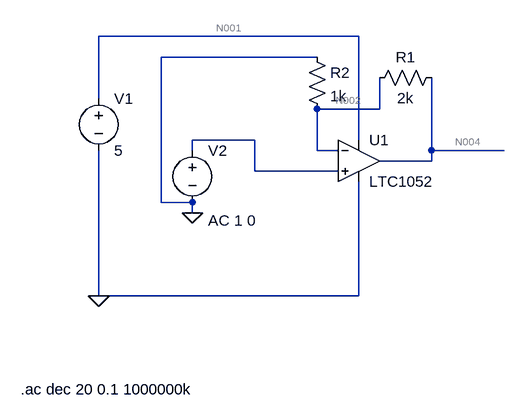
[diagram p0: schematic Non-invertAmp.asc]
Non-invertAmp.asc, the LTspice schematic file:
Version 4
SHEET 1 880 680
WIRE 224 -112 -176 -112
WIRE 160 -80 -80 -80
WIRE -176 -16 -176 -112
WIRE 256 0 256 -48
WIRE 256 0 160 0
WIRE 64 48 -32 48
WIRE 224 48 224 -112
WIRE -32 64 -32 48
WIRE 160 64 160 0
WIRE 192 64 160 64
WIRE 336 64 336 -48
WIRE 448 64 336 64
WIRE 336 80 336 64
WIRE 336 80 256 80
WIRE 64 96 64 48
WIRE 192 96 64 96
WIRE -80 144 -80 -80
WIRE -32 144 -80 144
WIRE -32 160 -32 144
WIRE -176 288 -176 64
WIRE 224 288 224 112
WIRE 224 288 -176 288
FLAG -32 160 0
FLAG -176 288 0
SYMBOL voltage -176 -32 R0
WINDOW 123 0 0 Left 2
WINDOW 39 0 0 Left 2
SYMATTR InstName V1
SYMATTR Value 5
SYMBOL voltage -32 48 R0
WINDOW 123 24 124 Left 2
WINDOW 39 0 0 Left 2
SYMATTR Value2 AC 1 0
SYMATTR InstName V2
SYMATTR Value ""
SYMBOL res 144 -96 R0
SYMATTR InstName R2
SYMATTR Value 1k
SYMBOL res 352 -64 R90
WINDOW 0 0 56 VBottom 2
WINDOW 3 32 56 VTop 2
SYMATTR InstName R1
SYMATTR Value 2k
SYMBOL Opamps\\LTC1052 224 16 R0
SYMATTR InstName U1
TEXT -296 432 Left 2 !.ac dec 20 0.1 1000000k

The netlist it stands for:
* Non-invertAmp.asc
V1 N001 0 5
V2 N003 0 AC 1 0
R2 0 N002 1k
R1 N004 N002 2k
XU1 N003 N002 N001 0 N004 LTC1052  ; pins In+ In- V+ V- OUT
.ac dec 20 0.1 1000000k
.backanno
.end

* Results of the author's LTspice run, read from the files saved beside the schematic
* Operating Point, zero values left out:
*   V(n001) = 5 V
*   V(n002) = 21.41 mV
*   V(n004) = 64.23 mV
*   I(R1) = 21.41 µA
*   I(R2) = -21.41 µA
*   I(V1) = -1.384 mA
*   Ix(u1:3) = 1.384 mA
*   Ix(u1:4) = -1.363 mA
*   Ix(u1:5) = -21.41 µA
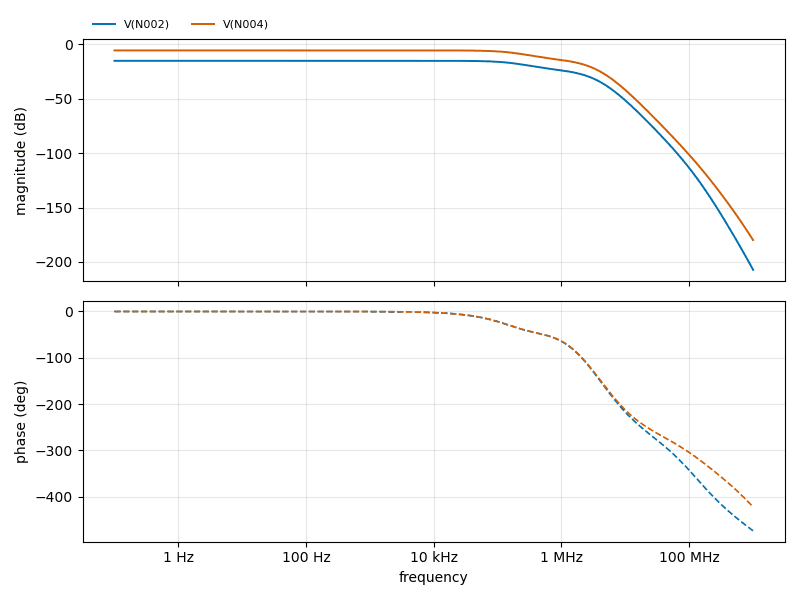
[diagram p1: AC Analysis of Non-invertAmp.asc, plotted from the saved traces]
* AC Analysis, 1 run:
*   V(N002): -15.00 dB at 100 mHz, -207.11 dB at 1 GHz, peak -15.00 dB at 100 mHz, 3 dB below the peak at 216.6 kHz
*   V(N004): -5.46 dB at 100 mHz, -179.87 dB at 1 GHz, peak -5.46 dB at 100 mHz, 3 dB below the peak at 216.6 kHz